# Altium project TouchSliders_ESP32_CAP1208.PrjPcb
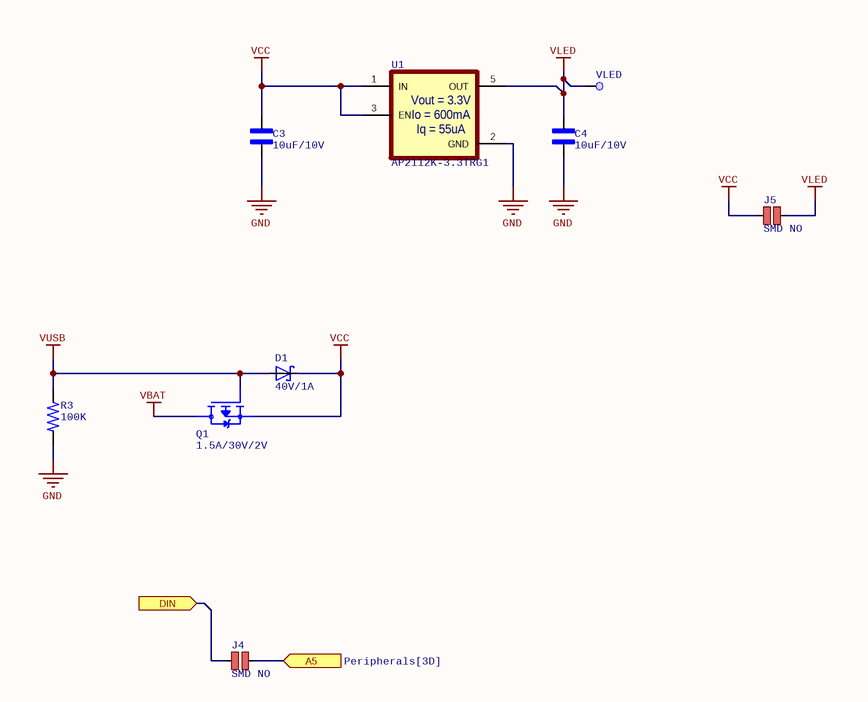
[diagram p0: Power_Supplies.SchDoc]
2 sheets, 26 parts. Net scope: flat (ports and power ports of the same name join across sheets).
Board file: TouchSlider_ESP32_CAP1208.PcbDoc
Sheets:
  Power_Supplies.SchDoc
  Peripherals.SchDoc

## Sheet Power_Supplies.SchDoc
size Letter; SheetNumber: 1; SheetTotal: 2

### Parts
C3  10uF/10V  [C0603]
C4  10uF/10V  [C0603]
D1  40V/1A  [SMA-2]
J4  SMD NO  [JUMPER_SMD_NO]  (net tie, no BOM)
J5  SMD NO  [JUMPER_SMD_NO]  (net tie, no BOM)
Q1  1.5A/30V/2V  [SOT-23-3]
R3  100K  [R0603]
U1  AP2112K-3.3TRG1  [SOT-25-5]
VLED  Test point 1.2mm  [TEST_POINT_1.2MM]  (value not drawn)  (no BOM)

### Ports
A5 (in, see Peripherals[3D]), DIN (in, see Peripherals[1C])

### Nets
GND: C3.2 C4.2 R3.2 U1.2(GND)
VBAT: Q1.3(D)
VCC: C3.1 D1.K J5.1 Q1.2(S) U1.1(IN) U1.3(EN)
VLED: C4.1 J5.2 U1.5(OUT) VLED.1
VUSB: D1.A Q1.1(G) R3.1
NetJ4_1: J4.1 ; port DIN
NetJ4_2: J4.2 ; port A5

### Notes on the sheet
- (in symbol AP2112K-3.3TRG1) Vout = 3.3V; Io = 600mA; Iq = 55uA

### Library data of the parts
C3 C4 = C0603 10uF/10V: MLCC 10uF 10V X5R 20% 0603; Manufacturer: Samsung; Manufacturer Part Number: CL10A106MP8NNND; Supplier 1: Mouser; Supplier Part Number 1: 187-CL10A106MP8NNND; RoHS: Yes; Category: Ceramic Capacitors; Stock 1: 58774; Pricing 1: 1=0.20000, 10=0.14000, 50=0.14000, 100=0.06600, 1000=0.03900, 10000=0.03000 (USD); Supplier 2: Mouser; Supplier Part Number 2: 963-LMK107BBJ106MAHT; RoHS Compliant: Yes
D1 = SS14: SS14 Series 500 mV 1 A 40 V Max Reverse Voltage Schottky Rectifier - DO-214AC; Manufacturer: ON Semiconductor / Fairchild; Max Repetitive Reverse Voltage (Vrrm): 40V; Max Forward Surge Current (Ifsm): 40A; Average Rectified Current: 1A; Max Reverse Current: 200uA; Forward Voltage: 500mV; Polarity: Standard; Supplier 1: Mouser; Supplier Part Number 1: 512-SS14; Manufacturer Part Number: SS14; RoHS: Yes; Category: Schottky Diodes; Stock 1: 331320; Pricing 1: 1=0.37, 10=0.261, 50=0.261, 100=0.117, 1000=0.082, 10000=0.075 (USD); Mount: Surface Mount; Case/Package: DO-214AC; Number of Pins: 2; Weight: 0.003739oz; Min Operating Temperature: -65°C; Max Operating Temperature: 125°C; Packaging: Tape and Reel; Series: -; Package Quantity: 7500; Termination: SMD/SMT; Voltage Rating (DC): 40V; Max Reverse Voltage (DC): 40V; Forward Current: 1A; Peak Non-Repetitive Surge Current: 40A; Current Rating: 1A; Output Current: 1A; Current: 1A; Voltage: 40V; Length: 4.75mm; Width: 2.95mm; Height: 2.2mm; Radiation Hardening: No; RoHS Compliant: Yes; Reach SVHC Compliant: No; ComponentLink1URL: https://datasheet.ciiva.com/4713/ss14-197224-4713938.pdf?src-supplier=Mouser; ComponentLink1Description: https://datasheet.ciiva.com/4713/ss14-197224-4713938.pdf?src-supplier=Mouser; ComponentLink2URL: https://datasheet.ciiva.com/7965/1766303-7965241.pdf?src-supplier=Element14; ComponentLink2Description: https://datasheet.ciiva.com/7965/1766303-7965241.pdf?src-supplier=Element14; ComponentLink3URL: https://datasheet.ciiva.com/22651/1880990-22651980.pdf?src-supplier=Element14; ComponentLink3Description: https://datasheet.ciiva.com/22651/1880990-22651980.pdf?src-supplier=Element14; ComponentLink4URL: https://datasheet.ciiva.com/8303/ss19-8303766.pdf?src-supplier=Avnet; ComponentLink4Description: https://datasheet.ciiva.com/8303/ss19-8303766.pdf?src-supplier=Avnet; ComponentLink5URL: https://datasheet.ciiva.com/910/ss12-910696.pdf?src-supplier=Digikey; ComponentLink5Description: https://datasheet.ciiva.com/910/ss12-910696.pdf?src-supplier=Digikey; ComponentLink6URL: https://datasheet.ciiva.com/910/ss12-910697.pdf?src-supplier=Digikey; ComponentLink6Description: https://datasheet.ciiva.com/910/ss12-910697.pdf?src-supplier=Digikey; ComponentLink7URL: https://datasheet.ciiva.com/910/ss12-910695.pdf?src-supplier=Digikey; ComponentLink7Description: https://datasheet.ciiva.com/910/ss12-910695.pdf?src-supplier=Digikey
J4 J5 = JUMPER_SMD_NO: Rule: UNIONINDEX=0|RULEKIND=ShortCircuit|NETSCOPE=AnyNet|LAYERKIND=SameLayer|NAME=Schematic Short-Circuit Constraint|ALLOWED=TRUE|UNIT=Imperial
Q1 = MOSFET P-CH 30V/1.5A BSS314: MOSFET P-Ch -30V -1.5A SOT-23-3; Manufacturer: Infineon; Manufacturer Part Number: BSS314PE; Supplier 1: Mouser; Supplier Part Number 1: 726-BSS314PEH6327; RoHS: Yes; Stock 1: 2505; Pricing 1: 1=0.46000, 10=0.34700, 50=0.34700, 100=0.21700, 500=0.14800, 1000=0.11400, 3000=0.10200, 6000=0.09600, 9000=0.09400, 10000=0.09400 (USD); Number of Pins: 3; Packaging: Tape and Reel; RoHS Compliant: Yes; Halogen Free: Halogen Free; Supplier 2: Mouser; Supplier Part Number 2: 726-BSS314PEH6327XTS
R3 = R0603 100K: RES 0603 100K OHM 1% 1/10W; Manufacturer: Yageo; Manufacturer Part Number: RC0603FR-07100KL; Resistance: 100kR; Temperature Coefficient: 100ppm/°C; Power Rating: 100mW; Voltage Rating: 50V; Working Voltage: 75V; Supplier 1: Mouser; Supplier Part Number 1: 603-RC0603FR-07100KL; RoHS: Yes; Category: Chip SMD Resistors; Stock 1: 4536807; Case/Package: 0603; Case Code (Imperial): 0603; Case Code (Metric): 1608; Min Operating Temperature: -55°C; Max Operating Temperature: 155°C; Tolerance: 1%; Packaging: Tape and Reel; Length: 1.6mm; Pricing 1: 1=0.10000, 10=0.02100, 100=0.00900, 1000=0.00400, 5000=0.00300, 10000=0.00200 (USD); Resistor Type: Thick Film; Number of Pins: 2; Termination: SMD/SMT; Voltage Rating (DC): 50V; Depth: 0.8mm; REACH SVHC: No SVHC; Military Standard: Not; Lead Free: Lead Free; Number of Terminations: 2; Height: 0.45mm; Width: 0.8mm
U1 = AP2112K-3.3TRG1: IC REG LINEAR 3.3V 600MA SOT25; Manufacturer: Diodes; Min Input Voltage: 2.5V; Number of Outputs: 1; Dropout Voltage: 250mV; Max Input Voltage: 6V; Quiescent Current: 55uA; Polarity: Positive; Accuracy: 1.5%; Output Type: Fixed; Supplier 1: Mouser; Supplier Part Number 1: 621-AP2112K-3.3TRG1; Manufacturer Part Number: AP2112K-3.3TRG1; RoHS: Yes; Category: Voltage Regulators - Linear; Stock 1: 4864; Pricing 1: 1=0.47000, 10=0.31700, 50=0.31700, 100=0.15000, 1000=0.11600, 10000=0.08900 (USD); Mount: Surface Mount; Case/Package: SOT-23-5; Number of Pins: 5; Min Operating Temperature: -40°C; Max Operating Temperature: 85°C; Package Quantity: 1; Packaging: Tape and Reel; Output Voltage: 3.3V; Output Current: 600mA; Number of Regulators: 1; Max Output Current: 600mA; Length: 3.1mm; Width: 1.7mm; Height: 1.3mm; Lead Free: Lead Free; RoHS Compliant: Yes; ComponentLink1URL: https://datasheet.ciiva.com/29569/ap2112-29569917.pdf?src-supplier=Digi-Key; ComponentLink1Description: https://datasheet.ciiva.com/29569/ap2112-29569917.pdf?src-supplier=Digi-Key; ComponentLink2URL: https://datasheet.ciiva.com/29569/ap2112-29569918.pdf?src-supplier=Digi-Key; ComponentLink2Description: https://datasheet.ciiva.com/29569/ap2112-29569918.pdf?src-supplier=Digi-Key; ComponentLink3URL: https://datasheet.ciiva.com/29569/ap2112-29569919.pdf?src-supplier=Digi-Key; ComponentLink3Description: https://datasheet.ciiva.com/29569/ap2112-29569919.pdf?src-supplier=Digi-Key; ComponentLink4URL: https://datasheet.ciiva.com/30016/ap2112-30016792.pdf?src-supplier=Avnet; ComponentLink4Description: https://datasheet.ciiva.com/30016/ap2112-30016792.pdf?src-supplier=Avnet
VLED = Test point: SMD test point

## Sheet Peripherals.SchDoc
size Letter; SheetNumber: 3; SheetTotal: 3
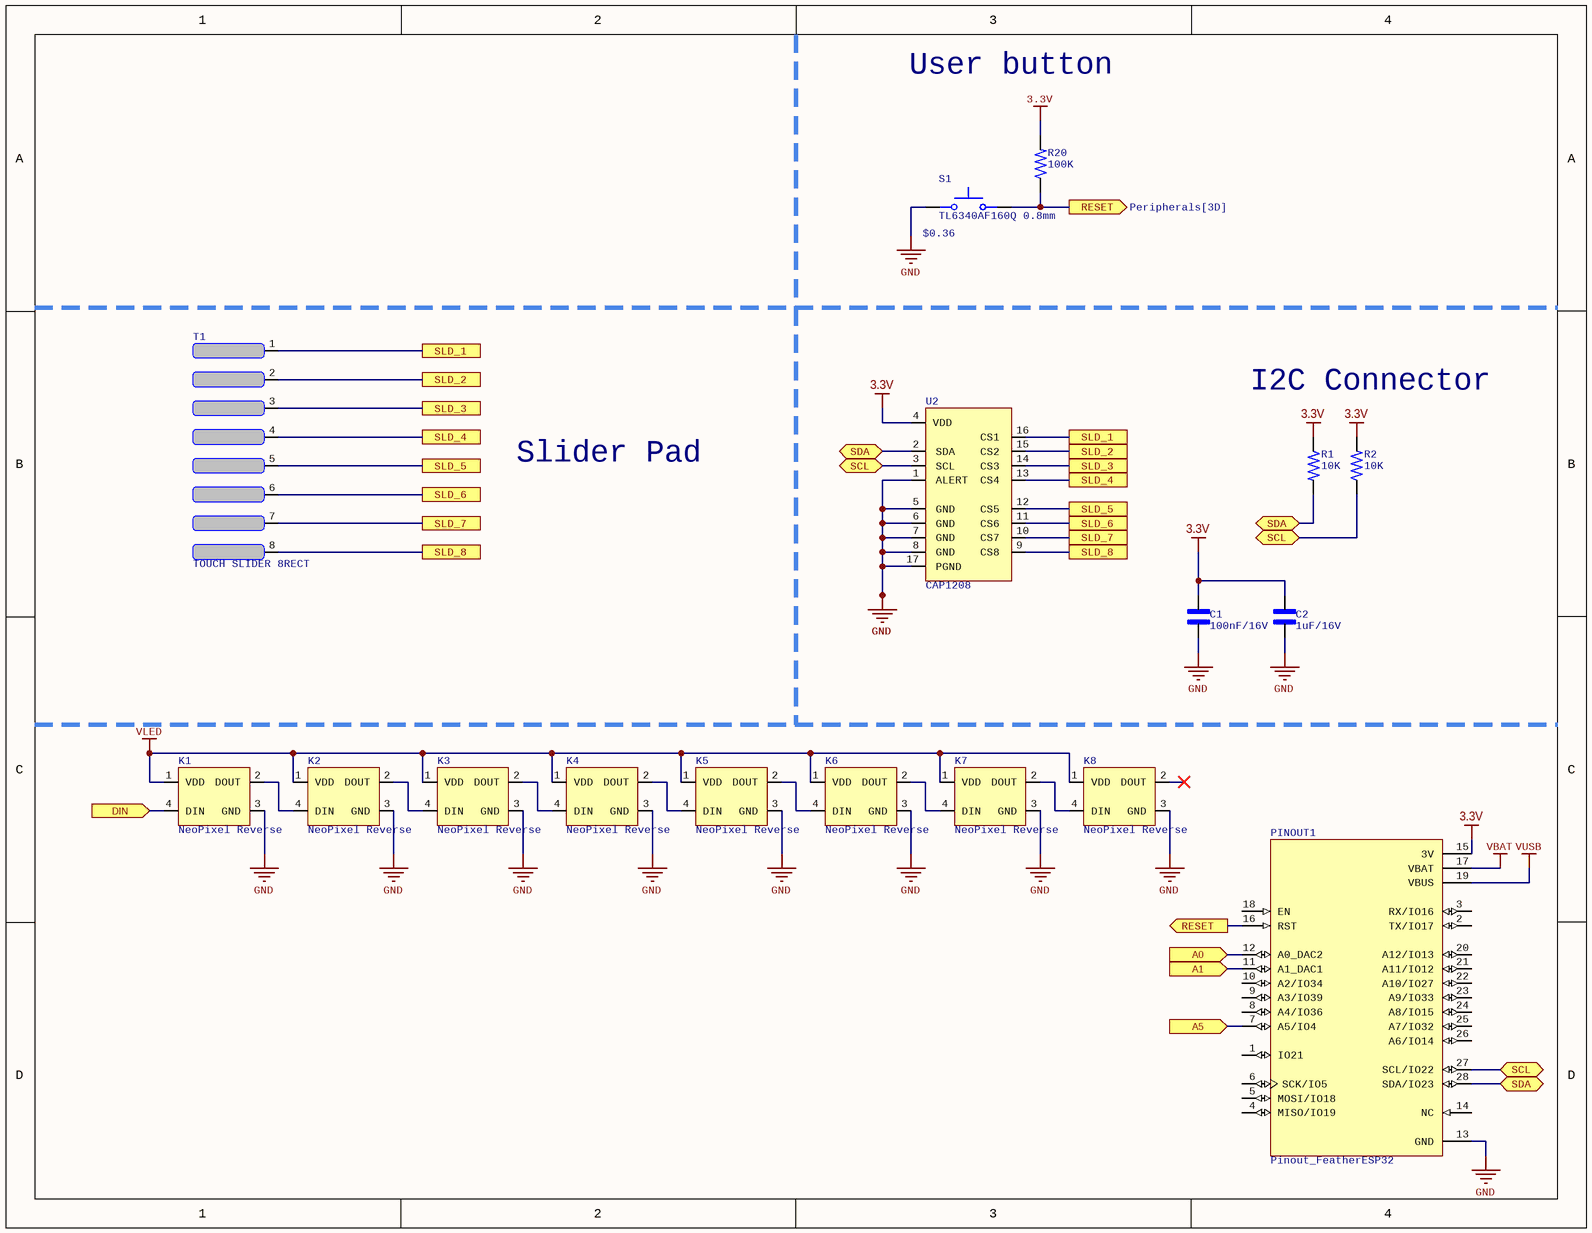
[diagram p1: Peripherals.SchDoc]

### Parts
C1  100nF/16V  [C0603]
C2  1uF/16V  [C0603]
K1  NeoPixel Reverse  [SK6812-E]
K2  NeoPixel Reverse  [SK6812-E]
K3  NeoPixel Reverse  [SK6812-E]
K4  NeoPixel Reverse  [SK6812-E]
K5  NeoPixel Reverse  [SK6812-E]
K6  NeoPixel Reverse  [SK6812-E]
K7  NeoPixel Reverse  [SK6812-E]
K8  NeoPixel Reverse  [SK6812-E]
PINOUT1  Pinout_FeatherESP32  [Pinout_FeatherESP32]
R1  10K  [R0603]
R2  10K  [R0603]
R20  100K  [R0603]
S1  TL6340AF160Q 0.8mm  Parameter 1: $0.36  [TL6340AF160Q]
T1  TOUCH SLIDER 8RECT  [TOUCH SLIDER 8-RECT KEPOUT]  (no BOM)
U2  CAP1208  [QFN16]

### Ports
A0 (in, see Power_Supplies[2C]), A1 (in, see Power_Supplies[2C]), A5 (in, see Power_Supplies[2C]), DIN (in, see Power_Supplies[2C]), RESET (out, see Peripherals[3A]), RESET (out, see Peripherals[3D]), SCL (bidir, see Peripherals[3B], Peripherals[4B]), SCL (bidir, see Peripherals[3B], Peripherals[4D]), SCL (bidir, see Peripherals[4B], Peripherals[4D]), SDA (bidir, see Peripherals[3B], Peripherals[4B]), SDA (bidir, see Peripherals[3B], Peripherals[4D]), SDA (bidir, see Peripherals[4B], Peripherals[4D]), SLD_1 (see Peripherals[2B]), SLD_1 (see Peripherals[3B]), SLD_2 (see Peripherals[2B]), SLD_2 (see Peripherals[3B]), SLD_3 (see Peripherals[2B]), SLD_3 (see Peripherals[3B]), SLD_4 (see Peripherals[2B]), SLD_4 (see Peripherals[3B]), SLD_5 (see Peripherals[2B]), SLD_5 (see Peripherals[3B]), SLD_6 (see Peripherals[2B]), SLD_6 (see Peripherals[3B]), SLD_7 (see Peripherals[2B]), SLD_7 (see Peripherals[3B]), SLD_8 (see Peripherals[2B]), SLD_8 (see Peripherals[3B])

### Nets
3.3V: C1.1 C2.1 PINOUT1.15(3V) R1.1 R2.2 R20.2 U2.4(VDD)
GND: C1.2 C2.2 K1.3(GND) K2.3(GND) K3.3(GND) K4.3(GND) K5.3(GND) K6.3(GND) K7.3(GND) K8.3(GND) PINOUT1.13(GND) S1.2 U2.1(ALERT) U2.5(GND) U2.6(GND) U2.7(GND) U2.8(GND) U2.17(PGND)
VBAT: PINOUT1.17(VBAT)
VLED: K1.1(VDD) K2.1(VDD) K3.1(VDD) K4.1(VDD) K5.1(VDD) K6.1(VDD) K7.1(VDD) K8.1(VDD)
VUSB: PINOUT1.19(VBUS)
NetJ4_1: K1.4(DIN) ; port DIN
NetJ4_2: PINOUT1.7(A5/IO4) ; port A5
NetK1_2: K1.2(DOUT) K2.4(DIN)
NetK2_2: K2.2(DOUT) K3.4(DIN)
NetK3_2: K3.2(DOUT) K4.4(DIN)
NetK4_2: K4.2(DOUT) K5.4(DIN)
NetK5_2: K5.2(DOUT) K6.4(DIN)
NetK6_2: K6.2(DOUT) K7.4(DIN)
NetK7_2: K7.2(DOUT) K8.4(DIN)
NetPINOUT1_11: PINOUT1.11(A1_DAC1) ; port A1
NetPINOUT1_12: PINOUT1.12(A0_DAC2) ; port A0
NetPINOUT1_16: PINOUT1.16(RST) R20.1 S1.1 ; port RESET
NetPINOUT1_27: PINOUT1.27(SCL/IO22) R2.1 U2.3(SCL) ; port SCL
NetPINOUT1_28: PINOUT1.28(SDA/IO23) R1.2 U2.2(SDA) ; port SDA
NetT1_1: T1.1 U2.16(CS1) ; port SLD_1
NetT1_2: T1.2 U2.15(CS2) ; port SLD_2
NetT1_3: T1.3 U2.14(CS3) ; port SLD_3
NetT1_4: T1.4 U2.13(CS4) ; port SLD_4
NetT1_5: T1.5 U2.12(CS5) ; port SLD_5
NetT1_6: T1.6 U2.11(CS6) ; port SLD_6
NetT1_7: T1.7 U2.10(CS7) ; port SLD_7
NetT1_8: T1.8 U2.9(CS8) ; port SLD_8

Not connected (* = marked no-connect by the designer): K8 2(DOUT)*; PINOUT1 1(IO21) 2(TX/IO17) 3(RX/IO16) 4(MISO/IO19) 5(MOSI/IO18) 6(SCK/IO5) 8(A4/IO36) 9(A3/IO39) 10(A2/IO34) 14(NC) 18(EN) 20(A12/IO13) 21(A11/IO12) 22(A10/IO27) 23(A9/IO33) 24(A8/IO15) 25(A7/IO32) 26(A6/IO14)

### Notes on the sheet
- User button
- I2C Connector
- Slider Pad

### Library data of the parts
C1 = C0603 100nF/16V: MLCC 0603 100nF 16V 10% X5R; Manufacturer 1: Kyocera AVX; Manufacturer Part Number 1: 0603YD104KAT2A; Supplier 1: Mouser; Supplier Part Number 1: 581-0603YD104KAT2A; RoHS: Yes; Category: Ceramic Capacitors; Stock 1: 3315; Pricing 1: 1=0.26000, 10=0.11400, 50=0.11400, 100=0.09700, 1000=0.05900, 10000=0.04800 (USD); Mount: Surface Mount; Case/Package: 0603; Number of Pins: 2; Case Code (Imperial): 0603; Case Code (Metric): 1608; Min Operating Temperature: -55°C; Max Operating Temperature: 85°C; Capacitance: 100nF; Package Quantity: 4000; Voltage Rating: 16V; Voltage Rating (DC): 16V; Tolerance: 10%; Packaging: Tape and Reel; Dielectric: X5R; Termination: SMD/SMT; Length: 1.6mm; Width: 0.81mm; Height: 0.9mm; Thickness: 0.035inch; Depth: 0.81mm; Lead Free: Lead Free
C2 = C0603 1uF/16V: MLCC 0603 1uF 16V 10% X5R; Manufacturer 1: Yageo; Manufacturer Part Number 1: CC0603KRX5R7BB105; Dissipation Factor: 7%; Supplier 1: Mouser; Supplier Part Number 1: 603-CC603KRX5R7BB105; RoHS: Yes; Category: Ceramic Capacitors; Stock 1: 726921; Pricing 1: 1=0.17000, 10=0.09100, 50=0.09100, 100=0.04100, 1000=0.03400, 10000=0.02100 (USD); Mount: Surface Mount; Case/Package: 0603; Number of Pins: 2; Case Code (Imperial): 0603; Case Code (Metric): 1608; Min Operating Temperature: -55°C; Max Operating Temperature: 85°C; Capacitance: 1uF; Tolerance: 10%; Dielectric: X5R; Voltage Rating: 16V; Voltage Rating (DC): 16V; Packaging: Tape and Reel; Package Quantity: 4000; Termination: SMD/SMT; Resistor Type: Ceramic; Series: CC; Construction: Flat; Length: 1.6mm; Width: 0.8mm; Height: 0.8mm; Thickness: 0.035inch; Depth: 0.8mm; Radiation Hardening: No; REACH SVHC: Unknown; Lead Free: Lead Free; Halogen Free: Halogen Free; RoHS Compliant: Yes
K1-K8 = SK6812-E: NeoPixel Reverse Mount RGB LEDs - SK6812-E; Manufacturer 1: Adafruit Industries; Manufacturer Part Number 1: 4960; Supplier 1: Mouser; Supplier Part Number 1: 485-4960; RoHS: No; Pricing 1: 1=2.95, 10=2.95, 50=2.95, 100=2.95, 1000=2.95, 10000=2.95 (USD); Supplier 2: LCSC; Supplier Part Number 2: C5149201
PINOUT1 = Pinout_FeatherESP32: Breadboard, Prepunched Insulating Non-Plated Through Hole (NPTH) 0.100 (2.54mm); MF: Keystone Electronics; MP: 3405; SnapEDA_Link: https://www.snapeda.com/parts/3405/Keystone%20Electronics/view-part/1260737/?ref=snap; Mouser-Purchase-URL: https://snapeda.com/shop?store=Mouser&id=1260737; Availability: Warning; Package: None; Value: *; Price: None; Arrow_Electronics-Purchase-URL: https://snapeda.com/shop?store=Arrow+Electronics&id=1260737
R1 R2 = R0603 10K: SMD Chip Resistor, 10 kOhm, ± 1%, 100 mW, 0603 [1608 Metric], Thick Film, Anti-Sulfur; Manufacturer 1: Yageo; Manufacturer Part Number 1: AF0603FR-0710KL; Power Rating: 100mW; Voltage Rating: 50V; Temperature Coefficient: 100ppm/°C; Value: 10kR; RoHS: Yes; Category: Chip SMD Resistors; Case/Package: 0603; Case Code (Imperial): 0603; Case Code (Metric): 1608; Min Operating Temperature: -55°C; Max Operating Temperature: 155°C; Tolerance: 1%; Packaging: Tape and Reel; Termination: SMD/SMT; Series: AF; Length: 0.063inch; RoHS Compliant: Yes; Lead Free: 5697LeadFree; Supplier 1: Mouser; Supplier Part Number 1: 603-AF0603FR-0710KL; Supplier 2: Mouser; Supplier Part Number 2: 667-ERJ-3EKF1002V; Stock 3: 5000; Pricing 3: 5000=0.00223, 10000=0.00219, 20000=0.00213 (USD); Package Quantity: 1; Number of Terminations: 2; Max Power Dissipation: 100mW; Features: Moisture Resistant,Anti-Sulfur; Width: 0.031inch; Height: 0.022inch
R20 = R0603 100K: RES 0603 100K OHM 1% 1/10W; Manufacturer 1: Yageo; Manufacturer Part Number 1: RC0603FR-07100KL; Power Rating: 100mW; Voltage Rating: 50V; Temperature Coefficient: 100ppm/°C; Resistance: 100kR; Working Voltage: 75V; RoHS: Yes; Category: Chip SMD Resistors; Case/Package: 0603; Case Code (Imperial): 0603; Case Code (Metric): 1608; Min Operating Temperature: -55°C; Max Operating Temperature: 155°C; Tolerance: 1%; Packaging: Tape and Reel; Termination: SMD/SMT; Length: 1.6mm; Lead Free: Lead Free; Supplier 1: Mouser; Supplier Part Number 1: 603-RC0603FR-07100KL; Number of Terminations: 2; Width: 0.8mm; Height: 0.45mm; Stock 1: 4536807; Pricing 1: 1=0.10000, 10=0.02100, 100=0.00900, 1000=0.00400, 5000=0.00300, 10000=0.00200 (USD); Number of Pins: 2; Resistor Type: Thick Film; Voltage Rating (DC): 50V; Depth: 0.8mm; REACH SVHC: No SVHC; Military Standard: Not
S1 = TL6340AF160Q 0.8mm: TACTILE SWITCH, SPST, 0.02A/12VDC, SMD; Product Range: TL6340 Series; Actuator Orientation: Side Actuated; Switch...; Manufacturer: E-Switch; Supplier 1: Mouser; Supplier Part Number 1: 612-TL6340AF160QG; Manufacturer Part Number: TL6340AF160Q; RoHS: Yes; Category: Tactile Switches; Stock 1: 2636; Pricing 1: 1=0.51, 10=0.478, 50=0.478, 100=0.46, 1000=0.36, 10000=0.255 (USD); Supplier 2: LCSC; Supplier Part Number 2: C4944967
T1 = TOUCH SLIDER 8RECT: 8-Segment touch slider
U2 = CAP1208: CAP1208 Series 8-Channel Capacitive Touch Surface Mount Proximity - QFN-16; Manufacturer: Microchip; Manufacturer Part Number: CAP1208-1-A4-TR; Interface: I2C,SMBus; Min Supply Voltage: 3V; Max Supply Voltage: 5.5V; Operating Supply Voltage: 5V; Number of Inputs: 8; Operating Supply Current: 500uA; Supplier 1: Mouser; Supplier Part Number 1: 579-CAP1208-1-A4-TR; RoHS: Yes; Category: Touch Screen Controllers; Stock 1: 19733; Pricing 1: 1=1.04, 10=1.04, 50=1, 100=0.93, 1000=0.93, 10000=0.929 (USD); Mounting Technology: Surface Mount; Case/Package: QFN; Pins: 16; Min Operating Temperature: -40°C; Max Operating Temperature: 125°C; Packaging: Tape and Reel; Package Quantity: 5000; Number of Channels: 8; Termination: SMD/SMT; Touchscreen: Capacitive; Series: -; Supply Current: 500uA; Length: 3mm; Width: 3mm; Reach SVHC Compliant: No; RoHS Compliant: Yes; ComponentLink1URL: https://datasheet.ciiva.com/28419/1772686-28419124.pdf?src-supplier=Element14; ComponentLink1Description: https://datasheet.ciiva.com/28419/1772686-28419124.pdf?src-supplier=Element14; ComponentLink2URL: https://datasheet.ciiva.com/29355/filehandler-aspxddocname-en566275-29355120.pdf?src-supplier=Digi-Key; ComponentLink2Description: https://datasheet.ciiva.com/29355/filehandler-aspxddocname-en566275-29355120.pdf?src-supplier=Digi-Key; ComponentLink3URL: https://datasheet.ciiva.com/24141/00001570a-278059-24141215.pdf?src-supplier=Mouser; ComponentLink3Description: https://datasheet.ciiva.com/24141/00001570a-278059-24141215.pdf?src-supplier=Mouser; ComponentLink4URL: https://datasheet.ciiva.com/29895/00001570a-29895445.pdf?src-supplier=Avnet; ComponentLink4Description: https://datasheet.ciiva.com/29895/00001570a-29895445.pdf?src-supplier=Avnet; ComponentLink5URL: https://datasheet.ciiva.com/39123/594000001570b-39123436.pdf?src-supplier=Onlinecomponents.com; ComponentLink5Description: https://datasheet.ciiva.com/39123/594000001570b-39123436.pdf?src-supplier=Onlinecomponents.com; Supplier 2: Digi-Key; Supplier Part Number 2: CAP1208-1-A4-TRCT-ND

## Nets that join several sheets
GND: Power_Supplies (C3.2 C4.2 R3.2 U1.2), Peripherals (18 pins)
VBAT: Power_Supplies (Q1.3), Peripherals (PINOUT1.17)
VLED: Power_Supplies (C4.1 J5.2 U1.5 VLED.1), Peripherals (8 pins)
VUSB: Power_Supplies (D1.A Q1.1 R3.1), Peripherals (PINOUT1.19)
NetJ4_1: Power_Supplies (J4.1), Peripherals (K1.4)
NetJ4_2: Power_Supplies (J4.2), Peripherals (PINOUT1.7)